# Altium schematic sheet PCIe_1x.SchDoc: Scuba Doo PCIe to USB Bridge
size B; Organization: CWRUbotix; Address1: 10900 Euclid Avenue; Address2: Cleveland, OH 44106; Address3: USA; SheetNumber: 4; SheetTotal: 6
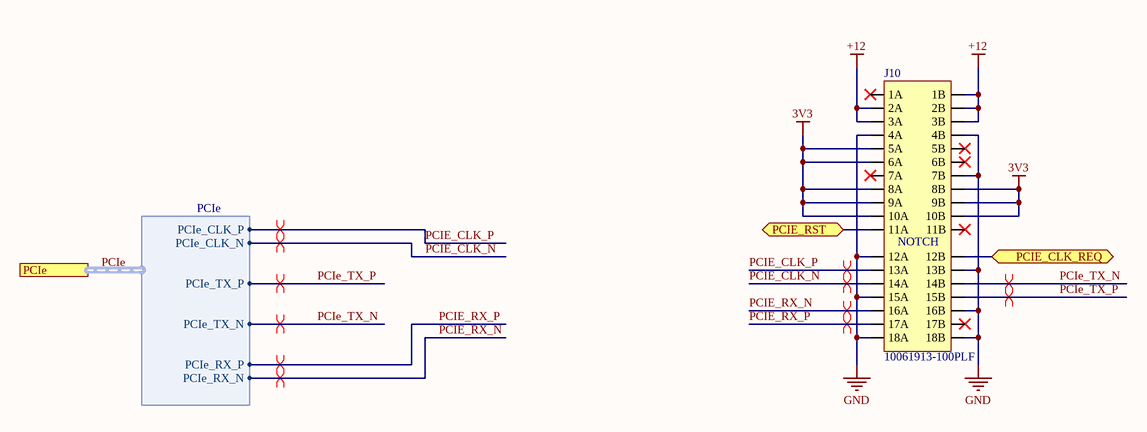
[diagram p0: PCIe_1x.SchDoc]

## Parts
J10  10061913-100PLF  [AMPHENOL_10061913]

## Ports
PCIe (harness PCIe), PCIE_CLK_REQ (bidir), PCIE_RST (bidir)

## Harnesses
PCIe: PCIe_CLK_P, PCIe_CLK_N, PCIe_TX_P, PCIe_TX_N, PCIe_RX_P, PCIe_RX_N

## Nets
3V3: J10.5A J10.6A J10.8A J10.8B J10.9A J10.9B J10.10A J10.10B
+12: J10.1B J10.2A J10.2B J10.3A J10.3B
GND: J10.4A J10.4B J10.7B J10.12A J10.13B J10.15A J10.16B J10.18A J10.18B
PCIE_CLK_N: J10.14A ; port PCIe.PCIe_CLK_N  [project net PCIe.PCIe_CLK_N]
PCIE_CLK_P: J10.13A ; port PCIe.PCIe_CLK_P  [project net PCIe.PCIe_CLK_P]
PCIE_CLK_REQ: J10.12A(12B) ; port PCIE_CLK_REQ
PCIE_RST: J10.11A ; port PCIE_RST
PCIE_RX_N: J10.16A ; port PCIe.PCIe_RX_N  [project net PCIe.PCIe_RX_N]
PCIE_RX_P: J10.17A ; port PCIe.PCIe_RX_P  [project net PCIe.PCIe_RX_P]
PCIe_TX_N: J10.14B ; port PCIe.PCIe_TX_N  [project net PCIe.PCIe_TX_N]
PCIe_TX_P: J10.15B ; port PCIe.PCIe_TX_P  [project net PCIe.PCIe_TX_P]

Not connected (* = marked no-connect by the designer): J10 1A* 5B* 6B* 7A* 11B* 17B*

## Buses and harness runs
harness PCIe = port PCIe

## Layout directives
differential pair; differential pair class PCIe: PCIe.PCIe_CLK_N, PCIe.PCIe_CLK_P, PCIe.PCIe_RX_N, PCIe.PCIe_RX_P, PCIe.PCIe_TX_N, PCIe.PCIe_TX_P

## Notes on the sheet
- Title
- Size:
- B
- Number:
- Revision:
- Date:
- Sheet
- of
- (in symbol CONN-00124) NOTCH

## Library data of the parts
J10 = CONN-00124: PCIe x1 Socket, 36-Pos, SMD, Amphenol; Positions per level: 36; Levels: 1; Part Number: CONN-00124; Type: Socket; Manufacturer: Amphenol; Manufacturer PN: 10061913-100PLF; Cost: 2.71; Distributor Link: https://www.digikey.com/en/products/detail/amphenol-icc-fci/10061913-100PLF/5200984